# EAGLE design clock_driver_board (EAGLE 7.4.0)
DATABASE: ../../PartsDatabase.txt
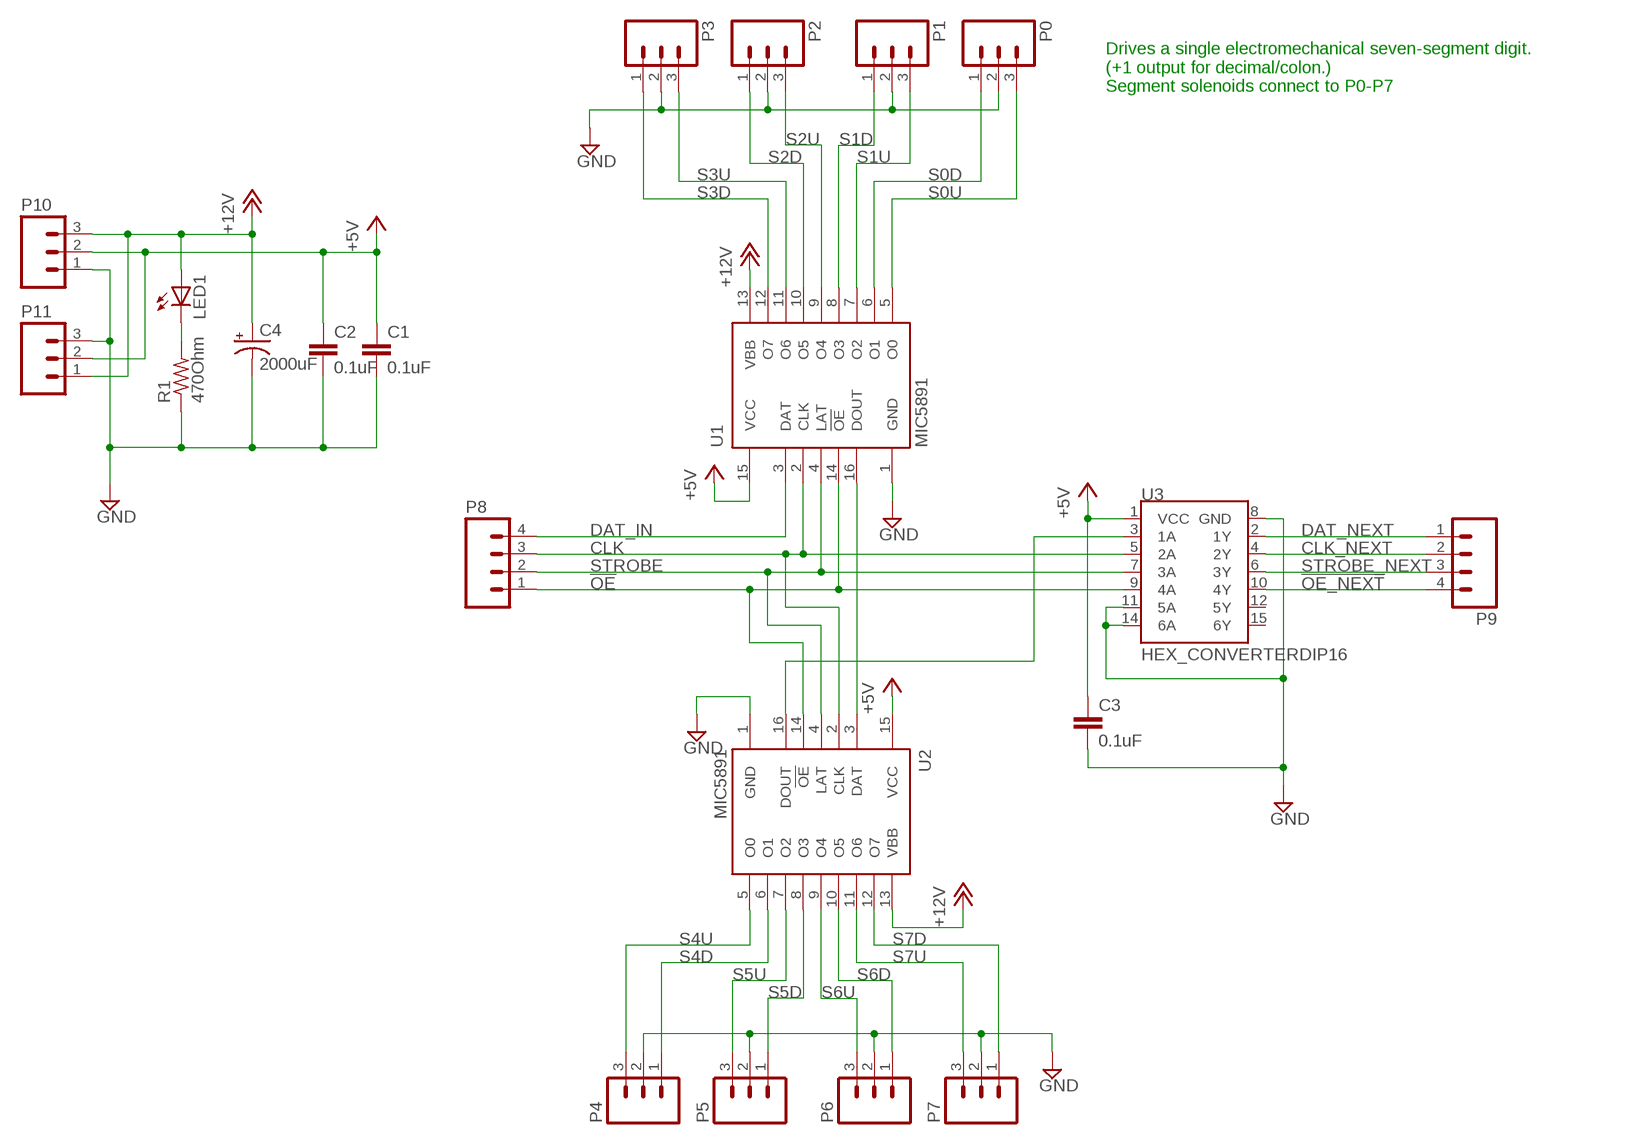
[diagram p0: schematic, sheet 1]

## Parts
C1  0.1uF  C2.5/2  [C2.5-2]
C2  0.1uF  C2.5/2  [C2.5-2]
C3  0.1uF  C2.5/2  [C2.5-2]
C4  2000uF  CPOL-USE7.5-16  [E7,5-16]
LED1  LED3MM  [LED3MM]
P0  M03LONGPADS  [1X03_LONGPADS]
P1  M03LONGPADS  [1X03_LONGPADS]
P2  M03LONGPADS  [1X03_LONGPADS]
P3  M03LONGPADS  [1X03_LONGPADS]
P4  M03LONGPADS  [1X03_LONGPADS]
P5  M03LONGPADS  [1X03_LONGPADS]
P6  M03LONGPADS  [1X03_LONGPADS]
P7  M03LONGPADS  [1X03_LONGPADS]
P8  M04LONGPADS  [1X04_LONGPADS]
P9  M04LONGPADS  [1X04_LONGPADS]
P10  M03SCREW  [SCREWTERMINAL-3.5MM-3]
P11  M03SCREW  [SCREWTERMINAL-3.5MM-3]
R1  470Ohm  R-US_0204/7  [0204/7]
U1  MIC5891  [DIL16]
U2  MIC5891  [DIL16]
U3  HEX_CONVERTERDIP16  [DIL16]

## Nets
!OE: P8.1 U1.14(!OE) U2.14(!OE) U3.9(4A)
!OE_NEXT: P9.4 U3.10(4Y)
+5V: C1.1 C2.1 C3.1 P10.2 P11.2 U1.15(VCC) U2.15(VCC) U3.1(VCC)
+12V: C4.+ LED1.A P10.3 P11.1 U1.13(VBB) U2.13(VBB)
CLK: P8.3 U1.2(CLK) U2.2(CLK) U3.5(2A)
CLK_NEXT: P9.2 U3.4(2Y)
DAT_IN: P8.4 U1.3(DAT)
DAT_NEXT: P9.1 U3.2(1Y)
GND: C1.2 C2.2 C3.2 C4.- P0.2 P1.2 P2.2 P3.2 P4.2 P5.2 P6.2 P7.2 P10.1 P11.3 R1.1 U1.1(GND) U2.1(GND) U3.8(GND) U3.11(5A) U3.14(6A)
LEDR: LED1.K(C) R1.2
N$21: U1.16(DOUT) U2.3(DAT)
N$26: U2.16(DOUT) U3.3(1A)
S0D: P0.1 U1.6(O1)
S0U: P0.3 U1.5(O0)
S1D: P1.1 U1.8(O3)
S1U: P1.3 U1.7(O2)
S2D: P2.1 U1.10(O5)
S2U: P2.3 U1.9(O4)
S3D: P3.1 U1.12(O7)
S3U: P3.3 U1.11(O6)
S4D: P4.1 U2.6(O1)
S4U: P4.3 U2.5(O0)
S5D: P5.1 U2.8(O3)
S5U: P5.3 U2.7(O2)
S6D: P6.1 U2.10(O5)
S6U: P6.3 U2.9(O4)
S7D: P7.1 U2.12(O7)
S7U: P7.3 U2.11(O6)
STROBE: P8.2 U1.4(LAT) U2.4(LAT) U3.7(3A)
STROBE_NEXT: P9.3 U3.6(3Y)
Unconnected: U3.12(5Y) U3.15(6Y)

## Notes on the sheet
- Drives a single electromechanical seven-segment digit.
  (+1 output for decimal/colon.)
  Segment solenoids connect to P0-P7

## Library data of the parts
C1-C3 = capacitor-wima:C: CAPACITOR naming: grid - package width; PARTNO: 21RZ310-RC
C4 = adafruit:CPOL-US: POLARIZED CAPACITOR, American symbol; PARTNO: EEU-TP1E202S
LED1 = adafruit:LED: LED OSRAM: - CHIPLED LG R971, LG N971, LY N971, LG Q971, LY Q971, LO R971, LY R971 LH N974, LH R974 LS Q976, LO Q976, LY Q976 LO Q996 - Hyper CHIPLED LW Q18S LB Q993, LB Q99A, LB R99A - SideLED LS A670, LO A670, LY A670, LG A670, LP A670 LB A673, LV A673, LT A673, LW A673 LH A674 LY A675 LS A676, LA A676, LO A676, LY A676, LW A676 LS A679, LY A679, LG A679 - Hyper Micro SIDELED® LS Y876, LA Y876, LO Y876, LY Y876 LT Y87S - SmartLED LW L88C, LW L88S LB L89C, LB L89S, LG L890 LS L89K, LO L89K, LY L89K LS L896, LA L896, LO L896, LY L896 - TOPLED LS T670, LO T670, LY T670, LG T670, LP T670 LSG T670, LSP T670, LSY T670, LOP T670, LYG T670 LG T671, LOG T671, LSG T671 LB T673, LV T673, LT T673, LW T673 LH T674 LS T676, LA T676, LO T676, LY T676, LB T676, LH T676, LSB T676, LW T676 LB T67C, LV T67C, LT T67C, LS T67K, LO T67K, LY T67K, LW E67C LS E67B, LA E67B, LO E67B, LY E67B, LB E67C, LV E67C, LT E67C LW T67C LS T679, LY T679, LG T679 LS T770, LO T770, LY T770, LG T770, LP T770 LB T773, LV T773, LT T773, LW T773 LH T774 LS E675, LA E675, LY E675, LS T675 LS T776, LA T776, LO T776, LY T776, LB T776 LHGB T686 LT T68C, LB T68C - Hyper Mini TOPLED® LB M676 - Mini TOPLED Santana® LG M470 LS M47K, LO M47K, LY M47K Source: http://www.osram.convergy.de/; PARTNO: WP7113SRD/D
P0 P1-P7 = SparkFun-Connectors:M03: Header 3 Standard 3-pin 0.1" header. Use with straight break away headers (SKU : PRT-00116), right angle break away headers (PRT-00553), swiss pins (PRT-00743), machine pins (PRT-00117), and female headers (PRT-00115). Molex polarized connector foot print use with SKU : PRT-08232 with associated crimp pins and housings.; BOM: EXCLUDE
P8 P9 = SparkFun-Connectors:M04: Header 4 Standard 4-pin 0.1" header. Use with straight break away headers (SKU : PRT-00116), right angle break away headers (PRT-00553), swiss pins (PRT-00743), machine pins (PRT-00117), and female headers (PRT-00115). Molex polarized connector foot print use with SKU : PRT-08231 with associated crimp pins and housings. 1MM SMD Version SKU: PRT-10208; PARTNO: 826631-4
P10 P11 = SparkFun-Connectors:M03: Header 3 Standard 3-pin 0.1" header. Use with straight break away headers (SKU : PRT-00116), right angle break away headers (PRT-00553), swiss pins (PRT-00743), machine pins (PRT-00117), and female headers (PRT-00115). Molex polarized connector foot print use with SKU : PRT-08232 with associated crimp pins and housings.; PARTNO: 1546551-3; PROD_ID: CONN-08288
R1 = resistor:R-US_: RESISTOR, American symbol; PARTNO: CFR-25JR-52-470R
U1 U2 = random:MIC5891: 8-Bit Serial-Input Latched Source Driver; PARTNO: MIC5891YN
U3 = SparkFun-DigitalIC:HEX_CONVERTER: 74HC4050 Hex Buffer Level Shifter SMD SO016; PARTNO: CD74HC4050E

## Board
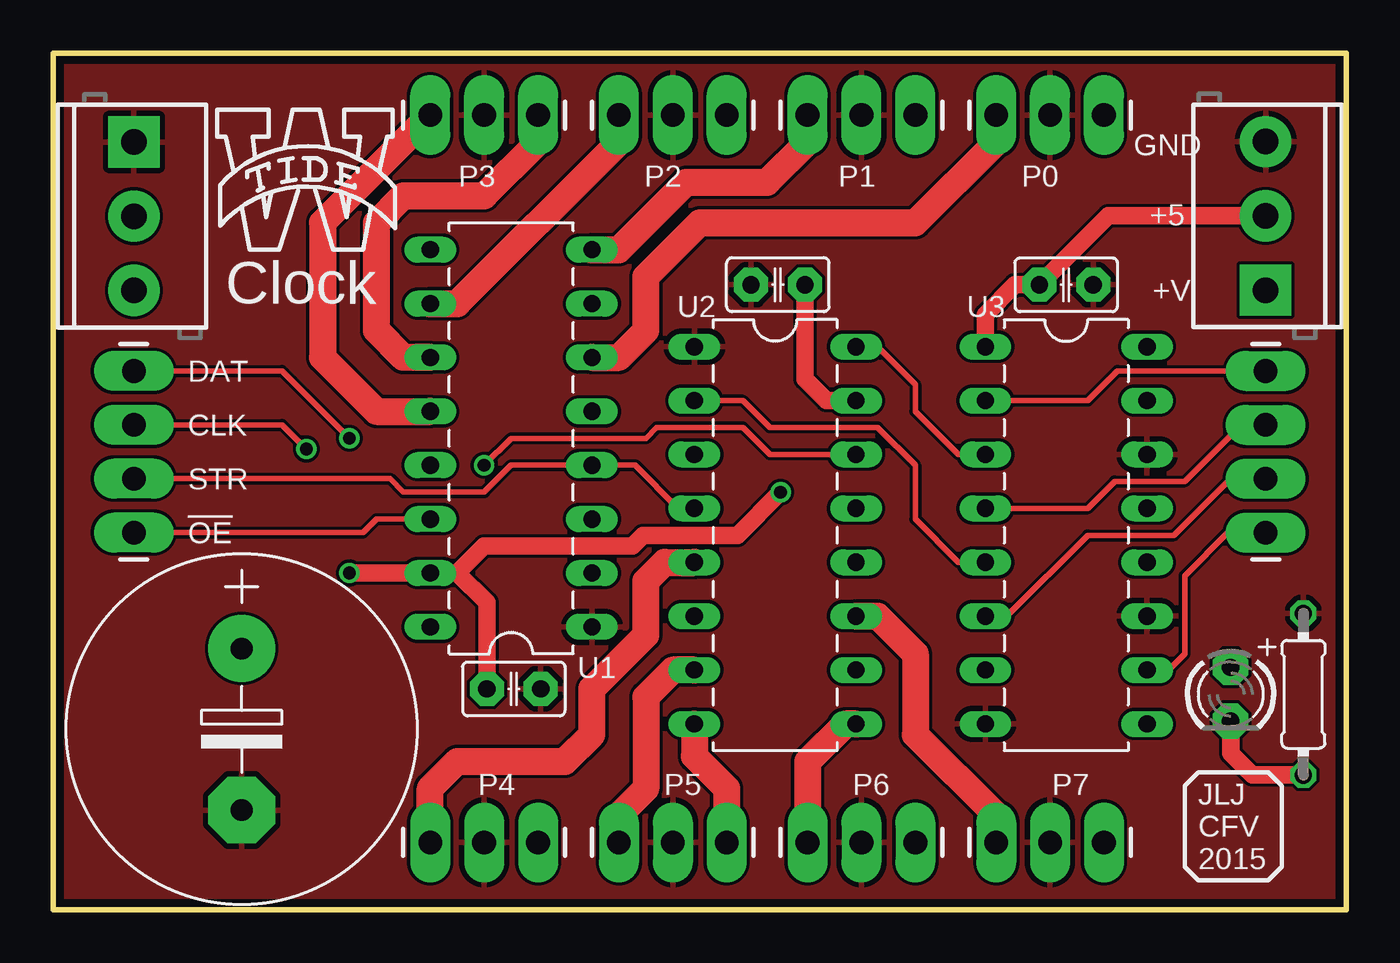
[diagram p1: board, top side]
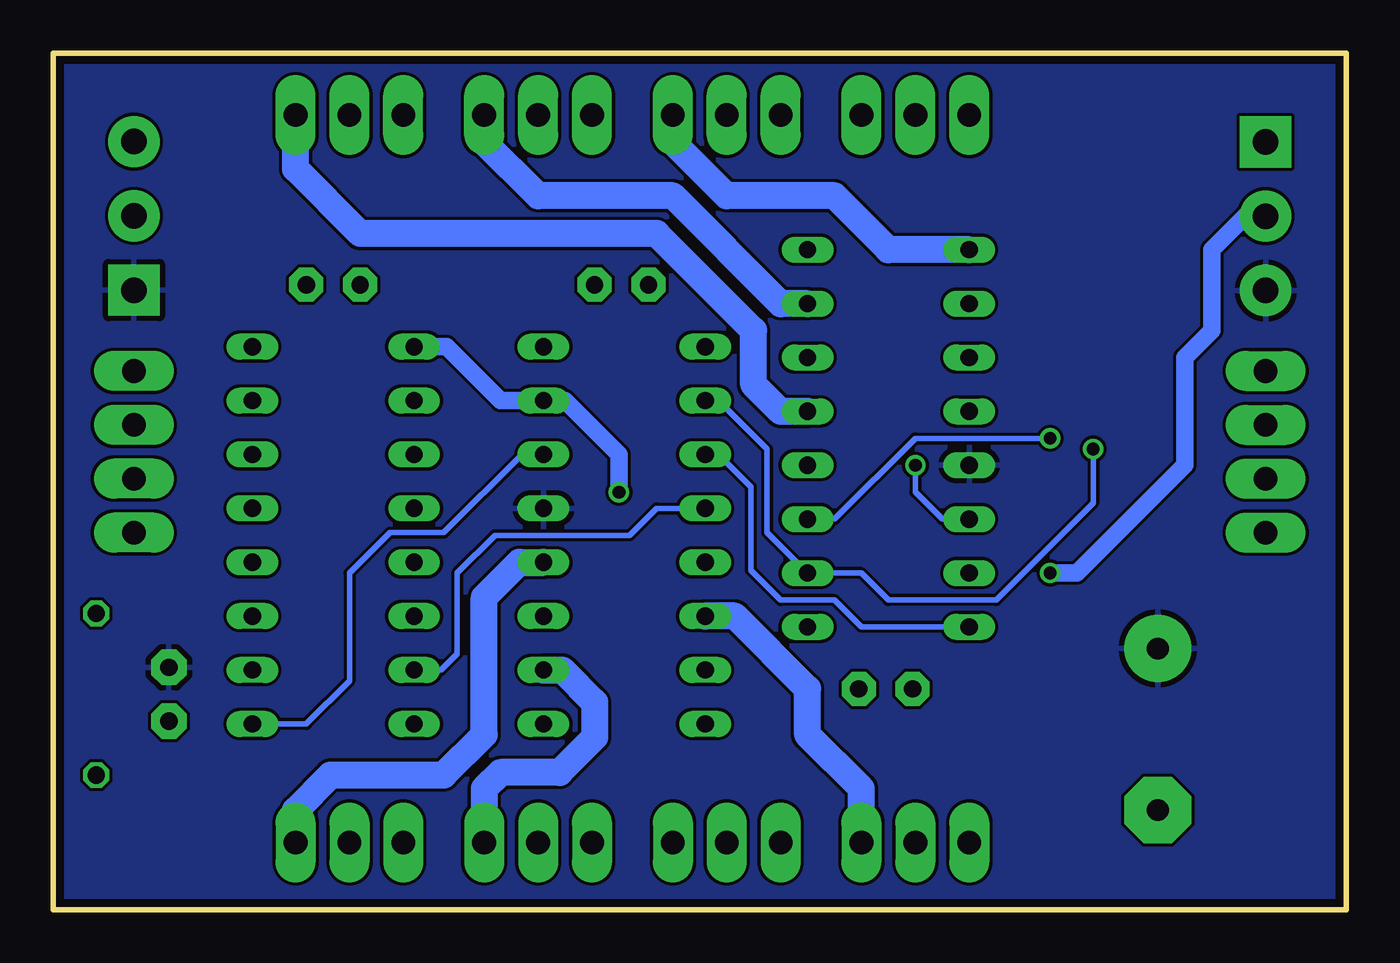
[diagram p2: board, bottom side, seen from below]

Size 60.96 x 40.39 mm. Coordinates in mm from the lower left corner, seen from the top.
Outline: 0,40.39 60.96,40.39 60.96,0 0,0 0,40.39
Copper layers (1*16): Top 0.0356mm / dielectric 1.5011mm / Bottom 0.0356mm
Design rules "oshpark-2layer": minimum track width 6mil, minimum drill 13mil, track to track 6mil, track to pad 6mil, pad to pad 6mil, via to via 6mil, smd to smd 6mil, copper to edge 15mil, drill to drill 6mil, minimum pad ring 7mil, minimum via ring 7mil, stop-mask expansion 4mil, vias tented up to drill 0mil, thermal gap 10mil

### Footprints (pad centres in the part's own frame; a part is rotated, then mirrored left to right if it is on the bottom)
C2.5-2 = drill 0.813 pad 1.6 octagon: 1 -1.27,0; 2 1.27,0
E7,5-16 = drill 1.016 pad 3.15: + -3.81,0 | drill 1.016 pad 3.15 octagon: - 3.81,0
LED3MM = drill 0.813 pad 1.676 octagon: A -1.27,0; K 1.27,0
1X03_LONGPADS = drill 1.118 pad 1.88 long: 1 0,0; 2 2.54,0; 3 5.08,0
1X04_LONGPADS = drill 1.118 pad 1.88 long: 1 0,0; 2 2.54,0; 3 5.08,0; 4 7.62,0
SCREWTERMINAL-3.5MM-3 = drill 1.2 pad 2.413 square: 1 0,0 | drill 1.2 pad 2.413: 2 3.5,0; 3 7,0
0204/7 = drill 0.813 octagon: 1 -3.81,0; 2 3.81,0
DIL16 = drill 0.813 long: 1 -8.89,-3.81; 2 -6.35,-3.81; 3 -3.81,-3.81; 4 -1.27,-3.81; 5 1.27,-3.81; 6 3.81,-3.81; 7 6.35,-3.81; 8 8.89,-3.81; 9 8.89,3.81; 10 6.35,3.81; 11 3.81,3.81; 12 1.27,3.81; 13 -1.27,3.81; 14 -3.81,3.81; 15 -6.35,3.81; 16 -8.89,3.81

### Placement (x,y rotation side)
C1  21.72,10.41 0 top
C2  34.16,29.46 180 top
C3  47.75,29.46 0 top
C4  8.89,8.51 270 top
LED1  55.5,10.16 270 top
P0  44.45,37.47 0 top
P1  35.56,37.47 0 top
P2  26.67,37.47 0 top
P3  17.78,37.47 0 top
P4  22.86,3.17 180 top
P5  31.75,3.17 180 top
P6  40.64,3.17 180 top
P7  49.53,3.17 180 top
P8  3.81,17.78 90 top
P9  57.15,25.4 270 top
P10  3.81,36.2 270 top
P11  57.15,29.21 90 top
R1  58.93,10.16 270 top
U1  21.59,22.22 90 top
U2  34.04,17.65 270 top
U3  47.75,17.65 270 top

### Tracks (layer width: path | path; a pad name or v marks a point on that pad's centre or on a via)
!OE  (via drill 0.6 pad 0.25)
  Top 0.254: P8.1 14.61,17.78 15.24,18.41 U1.14 | U2.14 33.78,21.46 32.51,22.73 28.45,22.73 27.94,22.22 21.59,22.22 v20.32,20.95
  Bottom 0.254: U3.9 49.02,8.76 46.99,10.79 46.99,15.88 45.09,17.78 42.55,17.78 38.86,21.46 U2.14 | v20.32,20.95 20.32,19.68 19.05,18.41 U1.14
!OE_NEXT
  Top 0.254: U3.10 52.58,11.3 53.34,12.06 53.34,15.75 55.37,17.78 P9.4
+5V  (via drill 0.6 pad 0.25)
  Top 0.813: U3.1 43.94,28.07 45.34,29.46 C3.1 49.73,32.71 P11.2 | C1.1 20.45,14.48 19.05,15.88 | C2.1 35.43,25.02 36.45,24 U2.15 | 19.05,15.88 U1.15 v13.97,15.88 | 19.05,15.88 20.32,17.14 27.3,17.14 27.81,17.65 32.26,17.65 v34.29,19.68
  Bottom 0.813: U3.1 42.42,26.54 39.88,24 U2.15 36.83,24 34.29,21.46 v34.29,19.68 | P10.2 4.77,32.7 6.35,31.11 6.35,27.3 7.62,26.04 7.62,20.95 12.7,15.88 v13.97,15.88
+12V
  pour Bottom: 0,40.39 60.96,40.39 60.96,0 0,0
CLK  (via drill 0.6 pad 0.25)
  Top 0.254: P8.3 10.79,22.86 v11.94,21.72 | U3.5 42.67,16.38 40.64,18.41 40.64,20.95 38.86,22.73 33.78,22.73 32.51,24 U2.2
  Bottom 0.254: v11.94,21.72 11.94,19.18 16.51,14.61 21.59,14.61 22.86,15.88 U1.2 27.3,17.78 27.3,21.72 29.59,24 U2.2
CLK_NEXT
  Top 0.254: U3.4 48.77,18.92 50.04,20.19 53.34,20.19 56.01,22.86 P9.2
DAT_IN  (via drill 0.6 pad 0.25)
  Top 0.254: P8.4 10.79,25.4 v13.97,22.22
  Bottom 0.254: U1.3 24.13,18.41 20.32,22.22 v13.97,22.22
DAT_NEXT
  Top 0.254: U3.2 48.77,24 50.16,25.4 P9.1
GND
  pour Top: 0,40.39 60.96,40.39 60.96,0 0,0
LEDR
  Top 0.813: LED1.K 55.5,7.37 56.52,6.35 R1.2
N$21
  Bottom 0.254: U1.16 22.86,13.34 24.13,14.61 26.67,14.61 28.07,16 28.07,19.94 29.59,21.46 U2.3
N$26
  Top 0.254: U2.16 38.86,26.54 40.64,24.76 40.64,23.49 42.67,21.46 U3.3
S0D
  Top 1.27: U1.6 26.67,26.04 27.94,27.3 27.94,29.84 30.48,32.39 40.64,32.39 44.45,36.2 P0.1
S0U
  Bottom 1.27: U1.5 26.67,23.49 27.94,24.76 27.94,27.3 32.51,31.88 46.48,31.88 49.53,34.93 P0.3
S1D
  Top 1.27: U1.8 26.67,31.11 29.84,34.29 33.66,34.29 35.56,36.2 P1.1
S1U
  Bottom 1.27: U1.7 26.67,28.57 31.75,33.66 38.1,33.66 40.64,36.2 P1.3
S2D
  Top 1.27: U1.10 19.05,28.57 26.67,36.2 P2.1
S2U
  Bottom 1.27: U1.9 21.59,31.11 24.13,33.66 29.21,33.66 31.75,36.2 P2.3
S3D
  Top 1.27: P3.1 12.7,32.39 12.7,26.04 15.24,23.49 U1.12
S3U
  Top 1.27: U1.11 16.51,26.04 15.24,27.3 15.24,32.39 16.51,33.66 20.32,33.66 22.86,36.2 P3.3
S4D
  Bottom 1.27: P4.1 22.86,5.71 25.4,8.26 25.4,10.41 28.83,13.84 U2.6
S4U
  Top 1.27: P4.3 17.78,5.71 19.05,6.99 24.13,6.99 25.4,8.26 25.4,10.41 27.94,12.95 27.94,15.49 28.83,16.38 U2.5
S5D
  Top 1.27: U2.8 30.23,7.24 31.75,5.71 P5.1
S5U
  Top 1.27: U2.7 29.21,11.3 27.94,10.03 27.94,5.71 26.67,4.45 P5.3
S6D
  Bottom 1.27: U2.10 36.96,11.3 35.43,9.78 35.43,8.13 37.08,6.48 39.88,6.48 40.64,5.71 P6.1
S6U
  Top 1.27: U2.9 37.34,8.76 35.56,6.99 P6.3
S7D
  Bottom 1.27: P7.1 49.53,4.7 47.88,6.35 42.55,6.35 40.64,8.26 40.64,14.73 38.99,16.38 U2.12
S7U
  Top 1.27: U2.11 38.86,13.84 40.64,12.06 40.64,8.26 44.45,4.45 P7.3
STROBE
  Top 0.254: P8.2 15.88,20.32 16.51,19.68 20.32,19.68 21.59,20.95 U1.4 27.43,20.95 29.46,18.92 U2.4
  Bottom 0.254: U2.4 32.51,18.92 33.78,17.65 40.13,17.65 41.91,15.88 41.91,12.06 42.67,11.3 U3.7
STROBE_NEXT
  Top 0.254: U3.6 44.96,13.84 48.77,17.65 52.83,17.65 55.5,20.32 P9.3

### Text on the board
tPlace: GND | +5 | Clock | +V | DAT | CLK | STR | !OE | JLJ / CFV / 2015